# EAGLE design v1 (EAGLE 9.6.2)
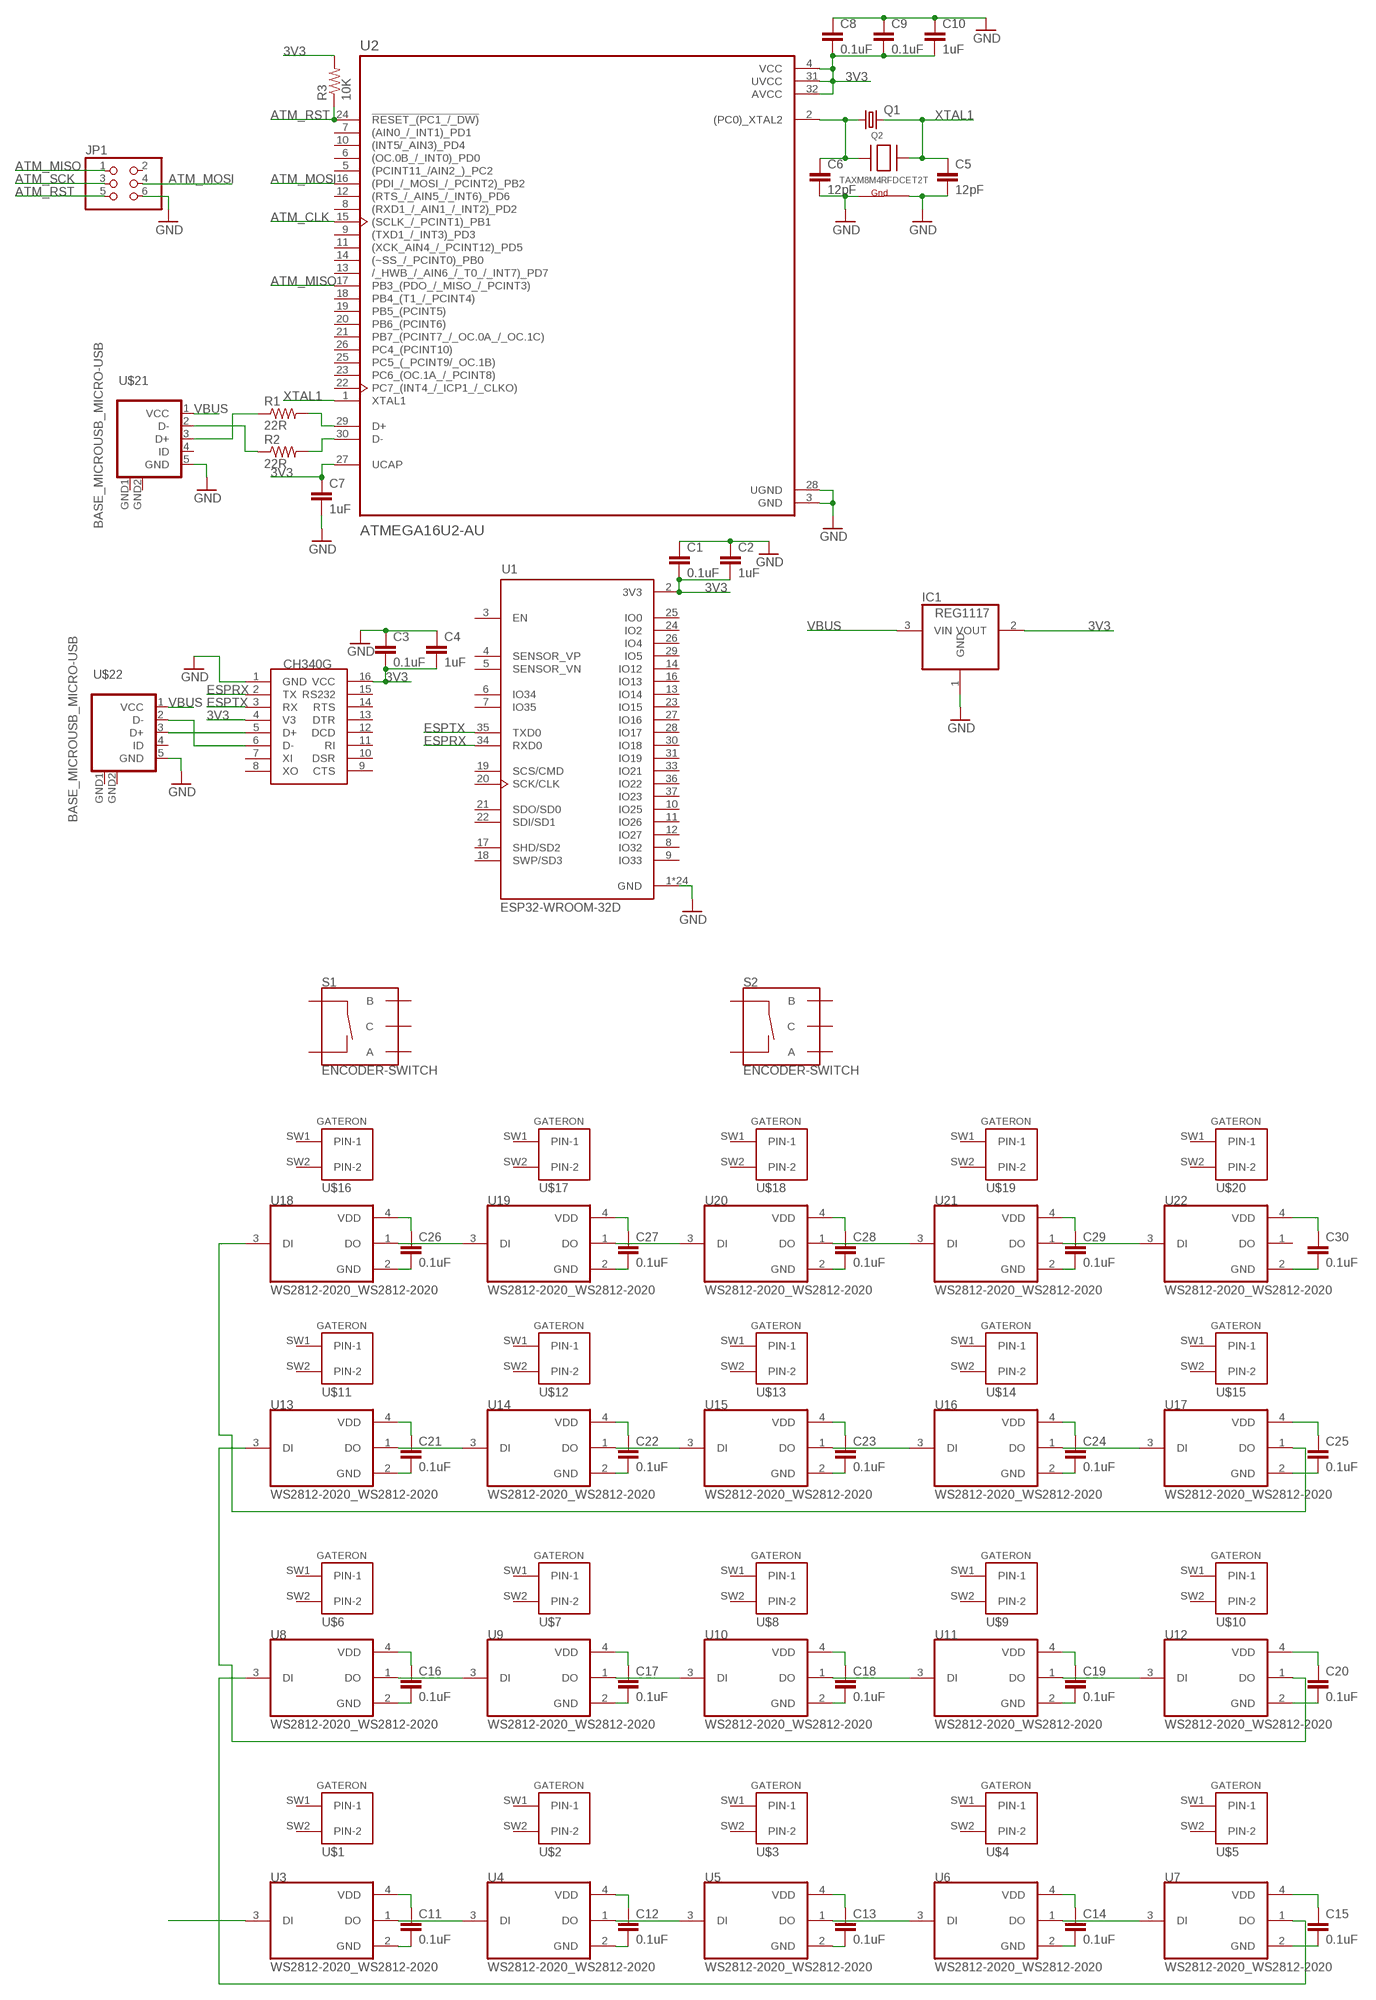
[diagram p0: schematic, sheet 1]

## Parts
C1  0.1uF  C-EUC0805  [C0805]
C2  1uF  C-EUC0805  [C0805]
C3  0.1uF  C-EUC0805  [C0805]
C4  1uF  C-EUC0805  [C0805]
C5  12pF  C-EUC0805  [C0805]
C6  12pF  C-EUC0805  [C0805]
C7  1uF  C-EUC0805  [C0805]
C8  0.1uF  C-EUC0805  [C0805]
C9  0.1uF  C-EUC0805  [C0805]
C10  1uF  C-EUC0805  [C0805]
C11  0.1uF  C-EUC0805  [C0805]
C12  0.1uF  C-EUC0805  [C0805]
C13  0.1uF  C-EUC0805  [C0805]
C14  0.1uF  C-EUC0805  [C0805]
C15  0.1uF  C-EUC0805  [C0805]
C16  0.1uF  C-EUC0805  [C0805]
C17  0.1uF  C-EUC0805  [C0805]
C18  0.1uF  C-EUC0805  [C0805]
C19  0.1uF  C-EUC0805  [C0805]
C20  0.1uF  C-EUC0805  [C0805]
C21  0.1uF  C-EUC0805  [C0805]
C22  0.1uF  C-EUC0805  [C0805]
C23  0.1uF  C-EUC0805  [C0805]
C24  0.1uF  C-EUC0805  [C0805]
C25  0.1uF  C-EUC0805  [C0805]
C26  0.1uF  C-EUC0805  [C0805]
C27  0.1uF  C-EUC0805  [C0805]
C28  0.1uF  C-EUC0805  [C0805]
C29  0.1uF  C-EUC0805  [C0805]
C30  0.1uF  C-EUC0805  [C0805]
IC1  REG1117  [SOT223]
JP1  PINHD-2X3  [2X03]
Q1  CRYSTALHC49UP  [HC49UP]
Q2  TAXM8M4RFDCET2T  XTAL-4-3225  [NX3225]
R1  22R  R-US_R0805  [R0805]
R2  22R  R-US_R0805  [R0805]
R3  10K  R-US_R0805  [R0805]
S1  ENCODER-SWITCH  [ROTARY_ENC_PLAIN]
S2  ENCODER-SWITCH  [ROTARY_ENC_PLAIN]
U1  ESP32-WROOM-32D  [MODULE_ESP32-WROOM-32D]
U2  ATMEGA16U2-AU  [QFP80P900X900X120-32N]
U3  WS2812-2020_WS2812-2020  [WS2812-2020_LED_WS2812-2020]
U4  WS2812-2020_WS2812-2020  [WS2812-2020_LED_WS2812-2020]
U5  WS2812-2020_WS2812-2020  [WS2812-2020_LED_WS2812-2020]
U6  WS2812-2020_WS2812-2020  [WS2812-2020_LED_WS2812-2020]
U7  WS2812-2020_WS2812-2020  [WS2812-2020_LED_WS2812-2020]
U8  WS2812-2020_WS2812-2020  [WS2812-2020_LED_WS2812-2020]
U9  WS2812-2020_WS2812-2020  [WS2812-2020_LED_WS2812-2020]
U10  WS2812-2020_WS2812-2020  [WS2812-2020_LED_WS2812-2020]
U11  WS2812-2020_WS2812-2020  [WS2812-2020_LED_WS2812-2020]
U12  WS2812-2020_WS2812-2020  [WS2812-2020_LED_WS2812-2020]
U13  WS2812-2020_WS2812-2020  [WS2812-2020_LED_WS2812-2020]
U14  WS2812-2020_WS2812-2020  [WS2812-2020_LED_WS2812-2020]
U15  WS2812-2020_WS2812-2020  [WS2812-2020_LED_WS2812-2020]
U16  WS2812-2020_WS2812-2020  [WS2812-2020_LED_WS2812-2020]
U17  WS2812-2020_WS2812-2020  [WS2812-2020_LED_WS2812-2020]
U18  WS2812-2020_WS2812-2020  [WS2812-2020_LED_WS2812-2020]
U19  WS2812-2020_WS2812-2020  [WS2812-2020_LED_WS2812-2020]
U20  WS2812-2020_WS2812-2020  [WS2812-2020_LED_WS2812-2020]
U21  WS2812-2020_WS2812-2020  [WS2812-2020_LED_WS2812-2020]
U22  WS2812-2020_WS2812-2020  [WS2812-2020_LED_WS2812-2020]
U$1  GATERON  [GATERON]
U$2  GATERON  [GATERON]
U$3  GATERON  [GATERON]
U$4  GATERON  [GATERON]
U$5  GATERON  [GATERON]
U$6  GATERON  [GATERON]
U$7  GATERON  [GATERON]
U$8  GATERON  [GATERON]
U$9  GATERON  [GATERON]
U$10  GATERON  [GATERON]
U$11  GATERON  [GATERON]
U$12  GATERON  [GATERON]
U$13  GATERON  [GATERON]
U$14  GATERON  [GATERON]
U$15  GATERON  [GATERON]
U$16  GATERON  [GATERON]
U$17  GATERON  [GATERON]
U$18  GATERON  [GATERON]
U$19  GATERON  [GATERON]
U$20  GATERON  [GATERON]
U$21  BASE_MICROUSB_MICRO-USB  [BASE_MICROUSB_MICRO-USB]
U$22  BASE_MICROUSB_MICRO-USB  [BASE_MICROUSB_MICRO-USB]
U$23  CH340G_CH340G  [CH340G_SOIC16]

## Nets
3V3: C1.2 C2.2 C3.2 C4.2 C7.1 C8.2 C9.2 C10.2 IC1.2(VOUT) R3.2 U1.2(3V3) U2.4(VCC) U2.27(UCAP) U2.31(UVCC) U2.32(AVCC) U$23.4(V3) U$23.16(VCC)
ATM_CLK: U2.15((SCLK_/_PCINT1)_PB1)
ATM_MISO: JP1.1 U2.17(PB3_(PDO_/_MISO_/_PCINT3))
ATM_MOSI: JP1.4 U2.16((PDI_/_MOSI_/_PCINT2)_PB2)
ATM_RST: JP1.5 R3.1 U2.24(!RESET_(PC1_/_DW))
ATM_SCK: JP1.3
ESPRX: U1.34(RXD0) U$23.2(TX)
ESPTX: U1.35(TXD0) U$23.3(RX)
GND: C1.1 C2.1 C3.1 C4.1 C5.2 C6.2 C7.2 C8.1 C9.1 C10.1 IC1.1(GND) JP1.6 Q2.2(G2) Q2.4(G1) U1.1(GND) U1.15(GND) U1.38(GND) U1.39_1(GND) U1.39_2(GND) U1.39_3(GND) U1.39_4(GND) U1.39_5(GND) U1.39_6(GND) U1.39_7(GND) U1.39_8(GND) U1.39_9(GND) U1.39_10(GND) U1.39_11(GND) U1.39_12(GND) U1.39_13(GND) U1.39_14(GND) U1.39_15(GND) U1.39_16(GND) U1.39_17(GND) U1.39_18(GND) U1.39_19(GND) U1.39_20(GND) U1.39_21(GND) U2.3(GND) U2.28(UGND) U$21.5(GND) U$22.5(GND) U$23.1(GND)
N$1: R1.1 U$21.3(D+)
N$2: R1.2 U2.29(D+)
N$3: R2.2 U2.30(D-)
N$4: U$22.2(D-) U$23.6(D-)
N$5: R2.1 U$21.2(D-)
N$6: U$22.3(D+) U$23.5(D+)
N$7: C6.1 Q1.1 Q2.1(X1) U2.2((PC0)_XTAL2)
N$8: U3.1(DO) U4.3(DI)
N$9: U4.1(DO) U5.3(DI)
N$10: U5.1(DO) U6.3(DI)
N$11: U6.1(DO) U7.3(DI)
N$12: U7.1(DO) U8.3(DI)
N$13: U8.1(DO) U9.3(DI)
N$14: U9.1(DO) U10.3(DI)
N$15: U10.1(DO) U11.3(DI)
N$16: U11.1(DO) U12.3(DI)
N$17: U12.1(DO) U13.3(DI)
N$18: U13.1(DO) U14.3(DI)
N$19: U14.1(DO) U15.3(DI)
N$20: U15.1(DO) U16.3(DI)
N$21: U16.1(DO) U17.3(DI)
N$22: U17.1(DO) U18.3(DI)
N$23: U18.1(DO) U19.3(DI)
N$24: U19.1(DO) U20.3(DI)
N$25: U20.1(DO) U21.3(DI)
N$26: U21.1(DO) U22.3(DI)
N$27: U3.3(DI)
N$28: C11.2 U3.2(GND)
N$29: C11.1 U3.4(VDD)
N$30: C12.1 U4.4(VDD)
N$31: C12.2 U4.2(GND)
N$32: C13.2 U5.2(GND)
N$33: C13.1 U5.4(VDD)
N$34: C14.1 U6.4(VDD)
N$35: C14.2 U6.2(GND)
N$36: C15.1 U7.4(VDD)
N$37: C15.2 U7.2(GND)
N$38: C20.1 U12.4(VDD)
N$39: C20.2 U12.2(GND)
N$40: C19.1 U11.4(VDD)
N$41: C19.2 U11.2(GND)
N$42: C18.1 U10.4(VDD)
N$43: C18.2 U10.2(GND)
N$44: C17.1 U9.4(VDD)
N$45: C17.2 U9.2(GND)
N$46: C16.1 U8.4(VDD)
N$47: C16.2 U8.2(GND)
N$48: C21.1 U13.4(VDD)
N$49: C21.2 U13.2(GND)
N$50: C22.1 U14.4(VDD)
N$51: C22.2 U14.2(GND)
N$52: C23.1 U15.4(VDD)
N$53: C23.2 U15.2(GND)
N$54: C24.1 U16.4(VDD)
N$55: C24.2 U16.2(GND)
N$56: C25.1 U17.4(VDD)
N$57: C25.2 U17.2(GND)
N$58: C30.1 U22.4(VDD)
N$59: C30.2 U22.2(GND)
N$60: C29.1 U21.4(VDD)
N$61: C29.2 U21.2(GND)
N$62: C28.1 U20.4(VDD)
N$63: C28.2 U20.2(GND)
N$64: C27.1 U19.4(VDD)
N$65: C27.2 U19.2(GND)
N$66: C26.1 U18.4(VDD)
N$67: C26.2 U18.2(GND)
VBUS: IC1.3(VIN) U$21.1(VCC) U$22.1(VCC)
XTAL1: C5.1 Q1.2 Q2.3(X2) U2.1(XTAL1)
Unconnected: JP1.2 S1.A S1.B S1.C S1.SW+ S1.SW- S2.A S2.B S2.C S2.SW+ S2.SW- U1.3(EN) U1.4(SENSOR_VP) U1.5(SENSOR_VN) U1.6(IO34) U1.7(IO35) U1.8(IO32) U1.9(IO33) U1.10(IO25) U1.11(IO26) U1.12(IO27) U1.13(IO14) U1.14(IO12) U1.16(IO13) U1.17(SHD/SD2) U1.18(SWP/SD3) U1.19(SCS/CMD) U1.20(SCK/CLK) U1.21(SDO/SD0) U1.22(SDI/SD1) U1.23(IO15) U1.24(IO2) U1.25(IO0) U1.26(IO4) U1.27(IO16) U1.28(IO17) U1.29(IO5) U1.30(IO18) U1.31(IO19) U1.33(IO21) U1.36(IO22) U1.37(IO23) U2.5((PCINT11_/AIN2_)_PC2) U2.6((OC.0B_/_INT0)_PD0) U2.7((AIN0_/_INT1)_PD1) U2.8((RXD1_/_AIN1_/_INT2)_PD2) U2.9((TXD1_/_INT3)_PD3) U2.10((INT5/_AIN3)_PD4) U2.11((XCK_AIN4_/_PCINT12)_PD5) U2.12((RTS_/_AIN5_/_INT6)_PD6) U2.13(/_HWB_/_AIN6_/_T0_/_INT7)_PD7) U2.14((~SS_/_PCINT0)_PB0) U2.18(PB4_(T1_/_PCINT4)) U2.19(PB5_(PCINT5)) U2.20(PB6_(PCINT6)) U2.21(PB7_(PCINT7_/_OC.0A_/_OC.1C)) U2.22(PC7_(INT4_/_ICP1_/_CLKO)) U2.23(PC6_(OC.1A_/_PCINT8)) U2.25(PC5_(_PCINT9/_OC.1B)) U2.26(PC4_(PCINT10)) U22.1(DO) U$1.SW1(PIN-1) U$1.SW2(PIN-2) U$2.SW1(PIN-1) U$2.SW2(PIN-2) U$3.SW1(PIN-1) U$3.SW2(PIN-2) U$4.SW1(PIN-1) U$4.SW2(PIN-2) U$5.SW1(PIN-1) U$5.SW2(PIN-2) U$6.SW1(PIN-1) U$6.SW2(PIN-2) U$7.SW1(PIN-1) U$7.SW2(PIN-2) U$8.SW1(PIN-1) U$8.SW2(PIN-2) U$9.SW1(PIN-1) U$9.SW2(PIN-2) U$10.SW1(PIN-1) U$10.SW2(PIN-2) U$11.SW1(PIN-1) U$11.SW2(PIN-2) U$12.SW1(PIN-1) U$12.SW2(PIN-2) U$13.SW1(PIN-1) U$13.SW2(PIN-2) U$14.SW1(PIN-1) U$14.SW2(PIN-2) U$15.SW1(PIN-1) U$15.SW2(PIN-2) U$16.SW1(PIN-1) U$16.SW2(PIN-2) U$17.SW1(PIN-1) U$17.SW2(PIN-2) U$18.SW1(PIN-1) U$18.SW2(PIN-2) U$19.SW1(PIN-1) U$19.SW2(PIN-2) U$20.SW1(PIN-1) U$20.SW2(PIN-2) U$21.4(ID) U$22.4(ID) U$23.7(XI) U$23.8(XO) U$23.9(CTS) U$23.10(DSR) U$23.11(RI) U$23.12(DCD) U$23.13(DTR) U$23.14(RTS) U$23.15(RS232)

## Power pins joined to a net without a drawn wire
GND: U$21.GND1(GND) U$21.GND2(GND) U$22.GND1(GND) U$22.GND2(GND)

## Library data of the parts
C1-C30 = rcl:C-EU: CAPACITOR, European symbol; SPICEPREFIX: C
IC1 = burr-brown:REG1117: 800mA and 1A Low Dropout (LDO) Positive Regulator 1.8V, 2.5V, 2.85V, 3.3V, 5V, and Adj; MPN: REG1117; OC_FARNELL: 1097566; OC_NEWARK: 14P6981
JP1 = pinhead:PINHD-2X3: PIN HEADER
Q1 = crystal:CRYSTAL: CRYSTAL; OC_FARNELL: unknown; OC_NEWARK: unknown
Q2 = adafruit:XTAL-4: Classic 4-pin 3.2 x 2.5mm crystal
R1-R3 = rcl:R-US_: RESISTOR, American symbol; SPICEPREFIX: R
S1 S2 = SparkFun-Switches:ENCODER-SWITCH: Rotary Encoder w/ Select Switch Encoders rotate similarly to potentiometers, but they’re different from potentiometers in that an encoder has full rotation without limits. They output gray code so that you can tell how much and in which direction the encoder has been turned. This encoder includes a push-down select switch built into the shaft. SparkFun Products Rotary Encoder <https://www.sparkfun.com/products/9117> (COM-09117); SF_SKU: COM-09117
U1 = ESP32-WROOM-32D:ESP32-WROOM-32D: Bluetooth, WiFi 802.11b/g/n, Bluetooth v4.2 + EDR, Class 1, 2 and 3 Transceiver Module 2.4GHz ~ 2.5GHz Integrated, Trace Surface Mount Check prices <https://pricing.snapeda.com/parts/ESP32-WROOM-32D/Espressif%20Systems/view-part?ref=eda>; AVAILABILITY: Not in stock; DESCRIPTION: Bluetooth, WiFi 802.11b/g/n, Bluetooth v4.2 +EDR, Class 1, 2 and 3 Transceiver Module 2.4GHz ~ 2.5GHz Integrated; MF: Espressif Systems; MP: ESP32-WROOM-32D; PACKAGE: Module Espressif Systems; PRICE: None
U2 = ATMEGA16U2-AU:ATMEGA16U2-AU: Check prices <https://pricing.snapeda.com/parts/ATMEGA16U2-AU/Microchip/view-part?ref=eda>; AVAILABILITY: No availability data; DESCRIPTION: AVR AVR® ATmega Microcontroller IC 8-Bit 16MHz 16KB (8K x 16) FLASH 32-TQFP (7x7); MF: Microchip; MP: ATMEGA16U2-AU; PACKAGE: TQFP-32 Microchip; PRICE: None
U3-U22 = design:WS2812-2020_WS2812-2020: Intelligent control LED integrated light source; AVAILABILITY: Unavailable; MF: Worldsemi; MP: WS2812-2020; PACKAGE: Package; PRICE: None
U$1-U$20 = gateron:GATERON: Gateron keyswitch
U$21 U$22 = design:BASE_MICROUSB_MICRO-USB: Micro USB B connector
U$23 = design:CH340G_CH340G

## Board
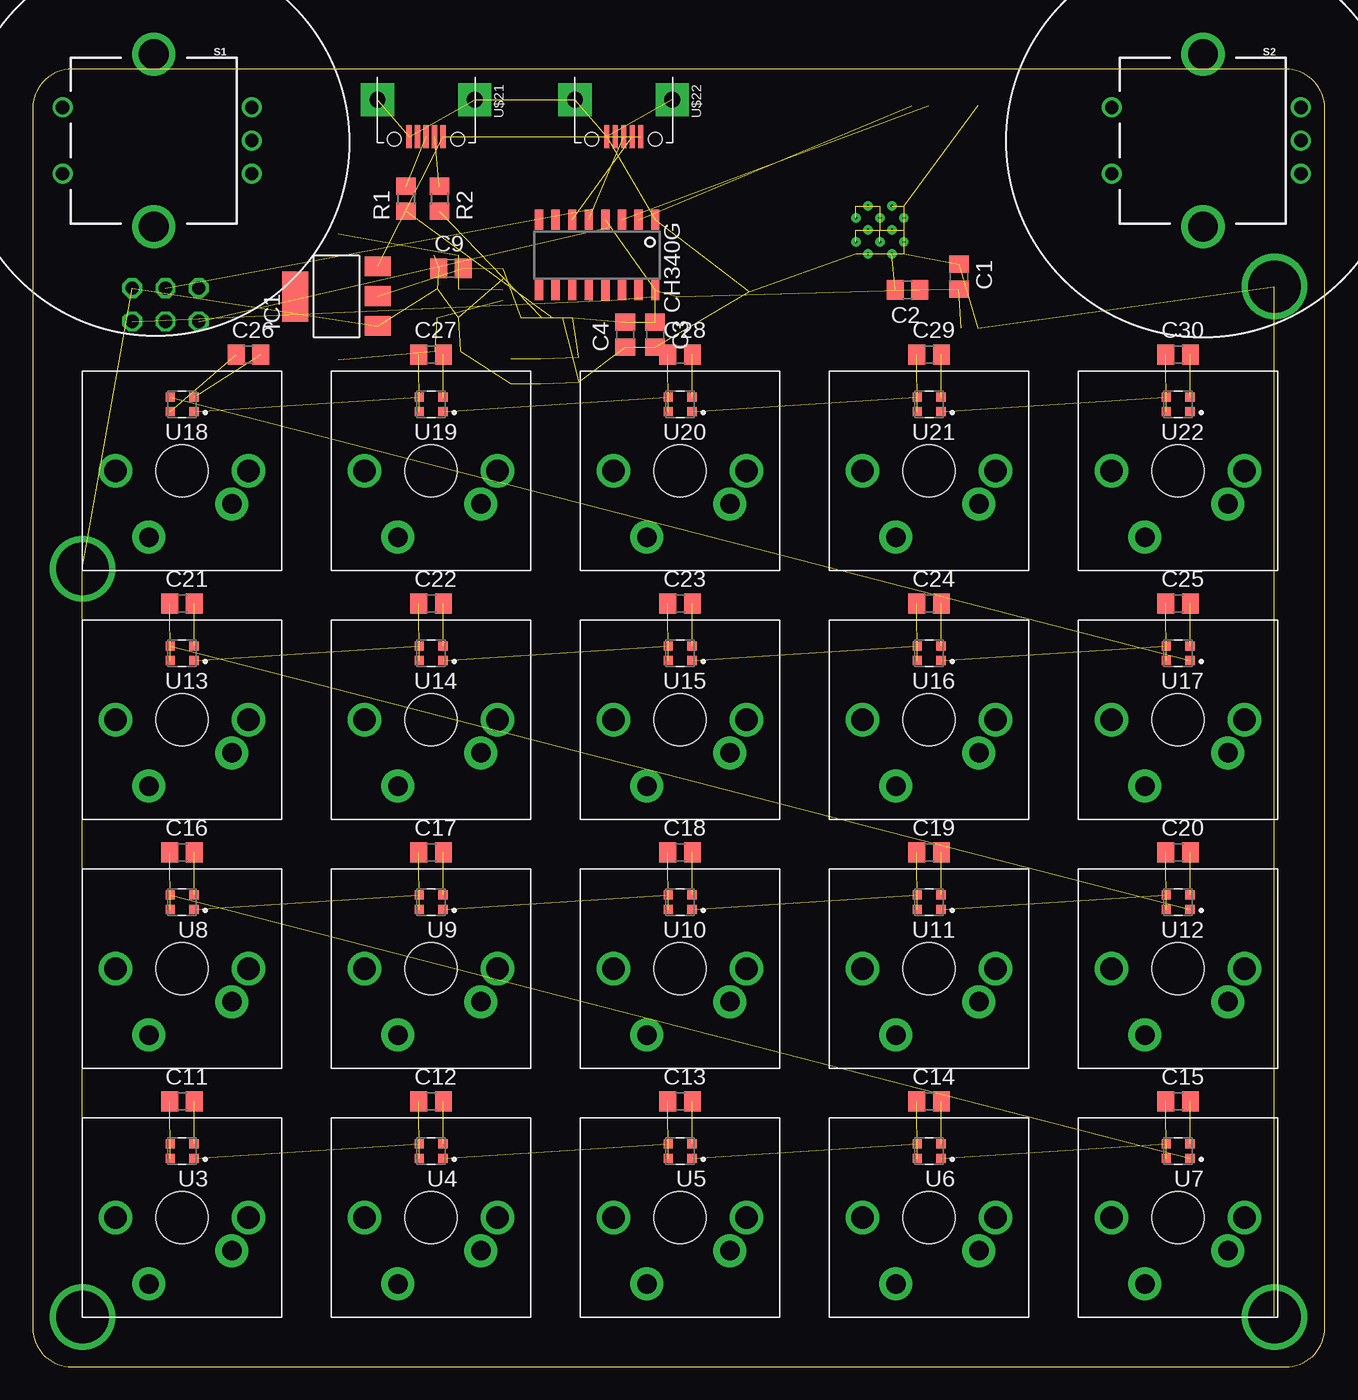
[diagram p1: board, top side]
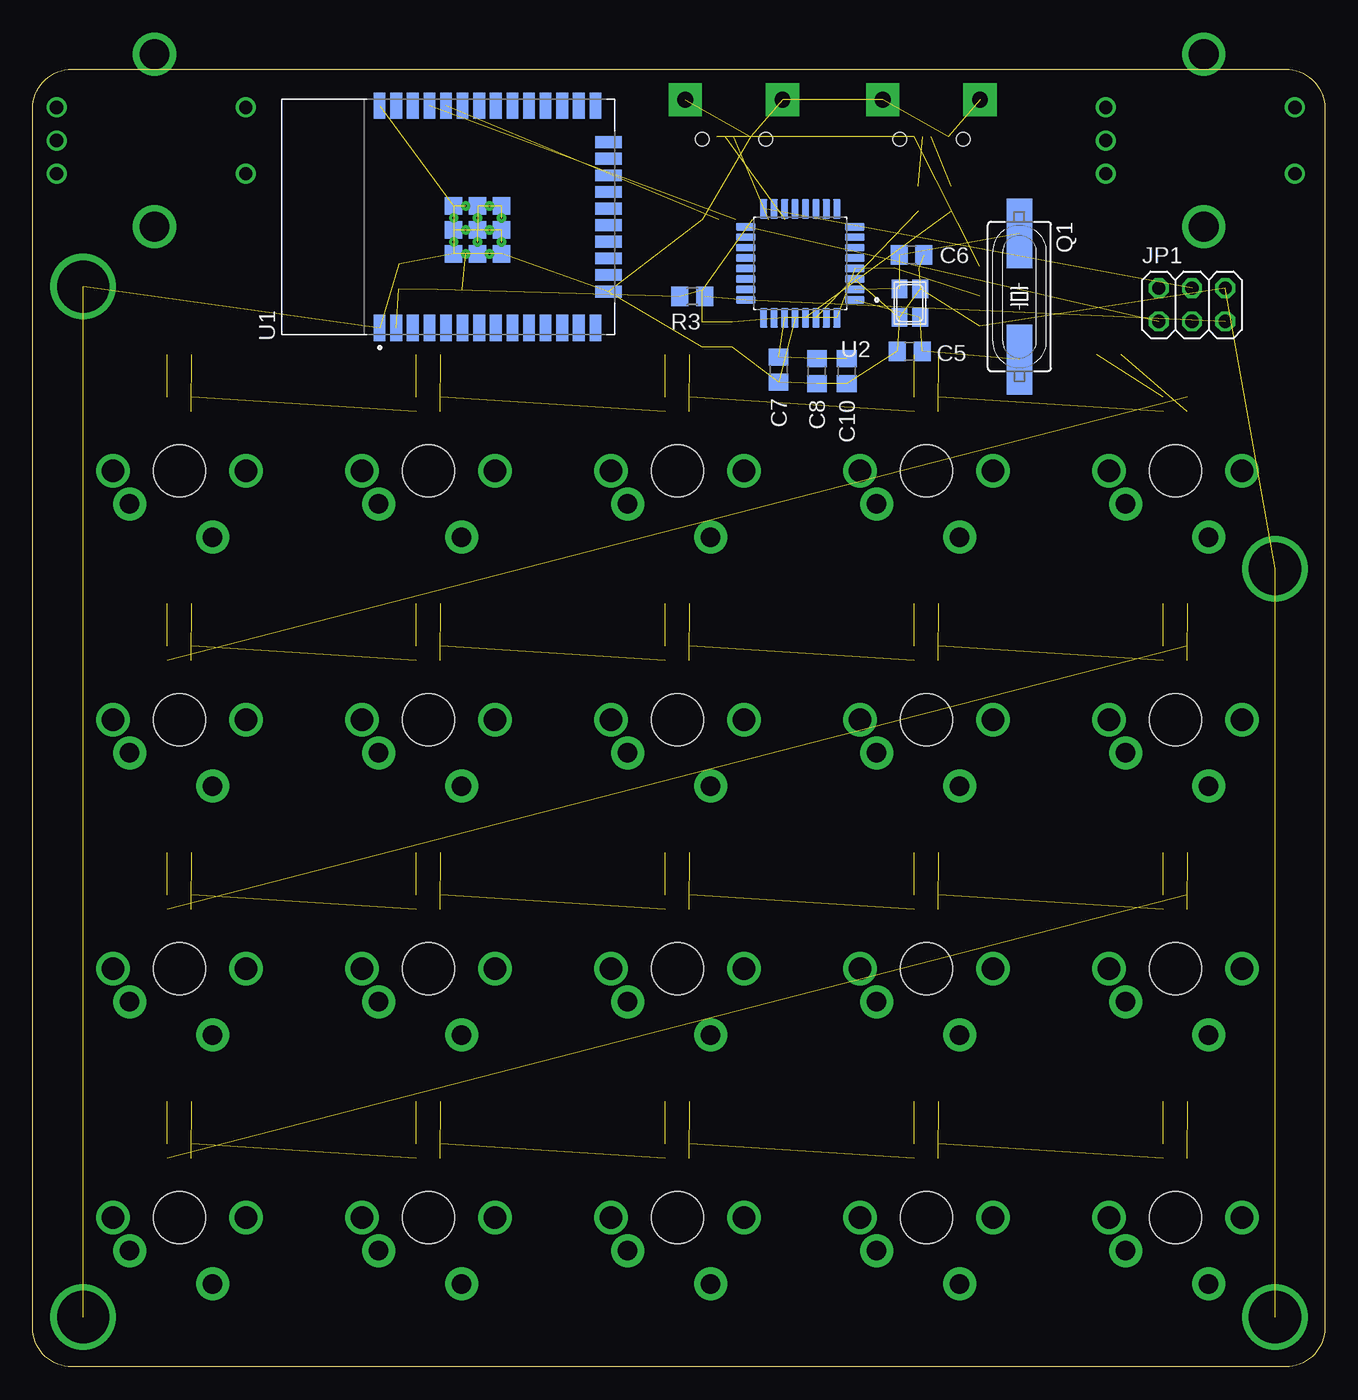
[diagram p2: board, bottom side, seen from below]

Size 98.86 x 99.3 mm. Coordinates in mm from the lower left corner, seen from the top.
Outline: 95.86,99.3 3,99.3 arc90 0,96.3 0,3 arc90 3,0 95.86,0 arc90 98.86,3 98.86,96.3 arc90 95.86,99.3
Copper layers (1*16): Top 0.035mm / dielectric 0.15mm / Bottom 0.035mm
Design rules "default": minimum track width 6mil, minimum drill 0.35mm, track to track 6mil, track to pad 6mil, pad to pad 6mil, via to via 6mil, smd to smd 6mil, copper to edge 40mil, drill to drill 6mil, minimum pad ring 10mil, minimum via ring 8mil, stop-mask expansion 4mil, vias tented up to drill 0mil, thermal gap 10mil

### Footprints (pad centres in the part's own frame; a part is rotated, then mirrored left to right if it is on the bottom)
C0805 = smd 1.3 x 1.5: 1 -0.95,0; 2 0.95,0
SOT223 = smd 1.499 x 2.007: 1 -2.261,-3.15; 2 0.025,-3.15; 3 2.311,-3.15 | smd 3.81 x 2.007: 4 0,3.15
2X03 = drill 1.016 octagon: 1 -2.54,-1.27; 2 -2.54,1.27; 3 0,-1.27; 4 0,1.27; 5 2.54,-1.27; 6 2.54,1.27
HC49UP = smd 5.334 x 1.93: 1 -4.826,0; 2 4.826,0
NX3225 = smd 1.4 x 1.2: 1 -1.1,-0.8; 2 1.1,-0.8; 3 1.1,0.8; 4 -1.1,0.8
R0805 = smd 1.3 x 1.5: 1 -0.95,0; 2 0.95,0
ROTARY_ENC_PLAIN = drill 1.016: A 7.493,-2.54; B 7.493,2.54; C 7.493,0; SW+ -6.985,2.54; SW- -6.985,-2.54 | drill 2.286: P$3 0,6.604; P$4 0,-6.604
MODULE_ESP32-WROOM-32D = smd 2 x 0.9: 1 -8.5,5.26; 2 -8.5,3.99; 3 -8.5,2.72; 4 -8.5,1.45; 5 -8.5,0.18; 6 -8.5,-1.09; 7 -8.5,-2.36; 8 -8.5,-3.63; 9 -8.5,-4.9; 10 -8.5,-6.17; 11 -8.5,-7.44; 12 -8.5,-8.71; 13 -8.5,-9.98; 14 -8.5,-11.25; 25 8.5,-11.25; 26 8.5,-9.98; 27 8.5,-8.71; 28 8.5,-7.44; 29 8.5,-6.17; 30 8.5,-4.9; 31 8.5,-3.63; 32 8.5,-2.36; 33 8.5,-1.09; 34 8.5,0.18; 35 8.5,1.45; 36 8.5,2.72; 37 8.5,3.99; 38 8.5,5.26 | smd 0.9 x 2: 15 -5.715,-12.25; 16 -4.445,-12.25; 17 -3.175,-12.25; 18 -1.905,-12.25; 19 -0.635,-12.25; 20 0.635,-12.25; 21 1.905,-12.25; 22 3.175,-12.25; 23 4.445,-12.25; 24 5.715,-12.25 | smd 1.33 x 1.33: 39_1 -2.835,-0.405; 39_2 -1,-0.405; 39_3 0.835,-0.405; 39_4 -2.835,-2.24; 39_5 -1,-2.24; 39_6 0.835,-2.24; 39_7 -2.835,-4.075; 39_8 -1,-4.075; 39_9 0.835,-4.075 | drill 0.2 pad 0.3: 39_10 -1.917,-0.405; 39_11 -0.083,-0.405; 39_12 -2.835,-1.323; 39_13 -1,-1.323; 39_14 0.835,-1.323; 39_15 -1.917,-2.24; 39_16 -0.083,-2.24; 39_17 -2.835,-3.158; 39_18 -1,-3.158; 39_19 0.835,-3.158; 39_20 -1.917,-4.075; 39_21 -0.083,-4.075
QFP80P900X900X120-32N = smd 1.49 x 0.55: 1 -4.17,2.8; 2 -4.17,2; 3 -4.17,1.2; 4 -4.17,0.4; 5 -4.17,-0.4; 6 -4.17,-1.2; 7 -4.17,-2; 8 -4.17,-2.8; 17 4.17,-2.8; 18 4.17,-2; 19 4.17,-1.2; 20 4.17,-0.4; 21 4.17,0.4; 22 4.17,1.2; 23 4.17,2; 24 4.17,2.8 | smd 0.55 x 1.49: 9 -2.8,-4.17; 10 -2,-4.17; 11 -1.2,-4.17; 12 -0.4,-4.17; 13 0.4,-4.17; 14 1.2,-4.17; 15 2,-4.17; 16 2.8,-4.17; 25 2.8,4.17; 26 2,4.17; 27 1.2,4.17; 28 0.4,4.17; 29 -0.4,4.17; 30 -1.2,4.17; 31 -2,4.17; 32 -2.8,4.17
WS2812-2020_LED_WS2812-2020 = smd 0.7 x 0.7: 1 -0.915,0.55; 2 -0.915,-0.55; 3 0.915,-0.55; 4 0.915,0.55
GATERON = drill 1.714 pad 1.93: P$3 -5.08,0; P$4 5.08,0 | drill 1.5 pad 2.54: SW1 -3.81,2.54; SW2 2.54,5.08 | hole 4: 0,0
BASE_MICROUSB_MICRO-USB = smd 0.4 x 1.75: 1 -1.3,4.525; 2 -0.65,4.525; 3 0,4.525; 4 0.65,4.525; 5 1.3,4.525 | drill 1.2 pad 2.54 square: GND1 -3.725,1.7; GND2 3.725,1.7 | hole 1.05: -2.425,4.73; 2.425,4.73
CH340G_SOIC16 = smd 0.635 x 1.524: 1 -4.445,-2.695; 2 -3.175,-2.695; 3 -1.905,-2.695; 4 -0.635,-2.695; 5 0.635,-2.695; 6 1.905,-2.695; 7 3.175,-2.695; 8 4.445,-2.695; 9 4.445,2.695; 10 3.175,2.695; 11 1.905,2.695; 12 0.635,2.695; 13 -0.635,2.695; 14 -1.905,2.695; 15 -3.175,2.695; 16 -4.445,2.695

### Placement (x,y rotation side)
C1  70.87,83.44 270 top
C2  66.93,82.42 0 top
C3  47.62,78.99 90 top
C4  45.34,78.99 90 top
C5  31.75,77.72 180 bottom
C6  31.62,85.09 0 bottom
C7  41.78,76.33 270 bottom
C8  38.86,76.2 90 bottom
C9  32,84.07 0 top
C10  36.58,76.2 90 bottom
C11  11.43,20.32 0 top
C12  30.48,20.32 0 top
C13  49.53,20.32 0 top
C14  68.58,20.32 0 top
C15  87.63,20.32 0 top
C16  11.43,39.37 0 top
C17  30.48,39.37 0 top
C18  49.53,39.37 0 top
C19  68.58,39.37 0 top
C20  87.63,39.37 0 top
C21  11.43,58.42 0 top
C22  30.48,58.42 0 top
C23  49.53,58.42 0 top
C24  68.58,58.42 0 top
C25  87.63,58.42 0 top
C26  16.51,77.47 0 top
C27  30.48,77.47 0 top
C28  49.53,77.47 0 top
C29  68.58,77.47 0 top
C30  87.63,77.47 0 top
IC1  23.24,81.92 90 top
JP1  10.16,81.28 0 bottom
Q1  23.37,81.92 270 bottom
Q2  31.75,81.41 270 bottom
R1  28.57,89.41 270 top
R2  31.11,89.41 270 top
R3  48.39,81.92 180 bottom
S1  9.27,93.85 0 top
S2  89.53,93.85 0 top
U1  67.06,88.01 90 bottom
U2  40.13,84.45 180 bottom
U3  11.43,16.51 180 top
U4  30.48,16.51 180 top
U5  49.53,16.51 180 top
U6  68.58,16.51 180 top
U7  87.63,16.51 180 top
U8  11.43,35.56 180 top
U9  30.48,35.56 180 top
U10  49.53,35.56 180 top
U11  68.58,35.56 180 top
U12  87.63,35.56 180 top
U13  11.43,54.61 180 top
U14  30.48,54.61 180 top
U15  49.53,54.61 180 top
U16  68.58,54.61 180 top
U17  87.63,54.61 180 top
U18  11.43,73.66 180 top
U19  30.48,73.66 180 top
U20  49.53,73.66 180 top
U21  68.58,73.66 180 top
U22  87.63,73.66 180 top
U$1  11.43,11.43 180 top
U$2  30.48,11.43 180 top
U$3  49.53,11.43 180 top
U$4  68.58,11.43 180 top
U$5  87.63,11.43 180 top
U$6  11.43,30.48 180 top
U$7  30.48,30.48 180 top
U$8  49.53,30.48 180 top
U$9  68.58,30.48 180 top
U$10  87.63,30.48 180 top
U$11  11.43,49.53 180 top
U$12  30.48,49.53 180 top
U$13  49.53,49.53 180 top
U$14  68.58,49.53 180 top
U$15  87.63,49.53 180 top
U$16  11.43,68.58 180 top
U$17  30.48,68.58 180 top
U$18  49.53,68.58 180 top
U$19  68.58,68.58 180 top
U$20  87.63,68.58 180 top
U$21  30.1,98.68 180 top
U$22  45.21,98.68 180 top
U$23  43.18,85.09 180 top

### Tracks (layer width: path | path; a pad name or v marks a point on that pad's centre or on a via)
3V3  (16 unrouted)
ATM_MISO  (1 unrouted)
ATM_MOSI  (1 unrouted)
ATM_RST  (2 unrouted)
ESPRX  (1 unrouted)
ESPTX  (1 unrouted)
GND  (via drill 4)  (50 unrouted)
  other vias: 3.81,3.81 95,82.68 95,3.81 3.81,61.09
N$1  (1 unrouted)
N$2  (1 unrouted)
N$3  (1 unrouted)
N$4  (1 unrouted)
N$5  (1 unrouted)
N$6  (1 unrouted)
N$7  (3 unrouted)
N$8  (1 unrouted)
N$9  (1 unrouted)
N$10  (1 unrouted)
N$11  (1 unrouted)
N$12  (1 unrouted)
N$13  (1 unrouted)
N$14  (1 unrouted)
N$15  (1 unrouted)
N$16  (1 unrouted)
N$17  (1 unrouted)
N$18  (1 unrouted)
N$19  (1 unrouted)
N$20  (1 unrouted)
N$21  (1 unrouted)
N$22  (1 unrouted)
N$23  (1 unrouted)
N$24  (1 unrouted)
N$25  (1 unrouted)
N$26  (1 unrouted)
N$28  (1 unrouted)
N$29  (1 unrouted)
N$30  (1 unrouted)
N$31  (1 unrouted)
N$32  (1 unrouted)
N$33  (1 unrouted)
N$34  (1 unrouted)
N$35  (1 unrouted)
N$36  (1 unrouted)
N$37  (1 unrouted)
N$38  (1 unrouted)
N$39  (1 unrouted)
N$40  (1 unrouted)
N$41  (1 unrouted)
N$42  (1 unrouted)
N$43  (1 unrouted)
N$44  (1 unrouted)
N$45  (1 unrouted)
N$46  (1 unrouted)
N$47  (1 unrouted)
N$48  (1 unrouted)
N$49  (1 unrouted)
N$50  (1 unrouted)
N$51  (1 unrouted)
N$52  (1 unrouted)
N$53  (1 unrouted)
N$54  (1 unrouted)
N$55  (1 unrouted)
N$56  (1 unrouted)
N$57  (1 unrouted)
N$58  (1 unrouted)
N$59  (1 unrouted)
N$60  (1 unrouted)
N$61  (1 unrouted)
N$62  (1 unrouted)
N$63  (1 unrouted)
N$64  (1 unrouted)
N$65  (1 unrouted)
N$66  (1 unrouted)
N$67  (1 unrouted)
VBUS  (2 unrouted)
XTAL1  (3 unrouted)